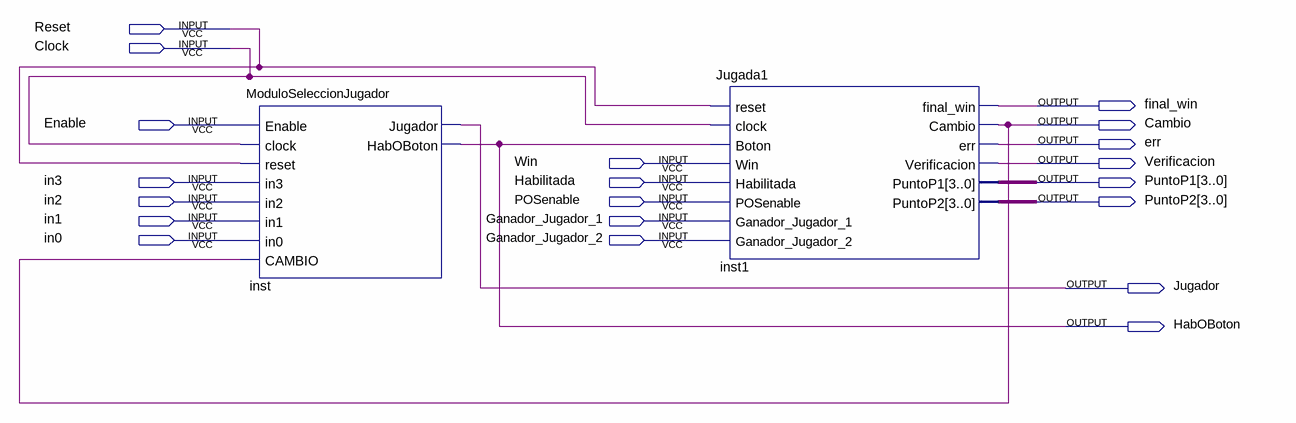
[diagram p0: schematic sheet]
// Quartus schematic MASIVO.bdf as structural Verilog: 2 symbols, 20 pins
module MASIVO (
  input  Reset,
  input  Clock,
  input  Enable,
  input  Win,
  input  in3,
  input  Habilitada,
  input  in2,
  input  POSenable,
  input  in1,
  input  Ganador_Jugador_1,
  input  in0,
  input  Ganador_Jugador_2,
  output final_win,
  output Cambio,
  output err,
  output Verificacion,
  output [3:0] PuntoP1,
  output [3:0] PuntoP2,
  output Jugador,
  output HabOBoton
);

  ModuloSeleccionJugador inst (
    .Enable(Enable), .clock(Clock), .reset(Reset), .in3(in3), .in2(in2), .in1(in1), .in0(in0),
    .CAMBIO(Cambio), .Jugador(Jugador), .HabOBoton(HabOBoton));
  Jugada1 inst1 (
    .reset(Reset), .clock(Clock), .Boton(HabOBoton), .Win(Win), .Habilitada(Habilitada),
    .POSenable(POSenable), .Ganador_Jugador_1(Ganador_Jugador_1), .Ganador_Jugador_2(Ganador_Jugador_2),
    .final_win(final_win), .Cambio(Cambio), .err(err), .Verificacion(Verificacion), .PuntoP1(PuntoP1),
    .PuntoP2(PuntoP2));
endmodule
